# EAGLE design flight board (EAGLE 8.2.0)
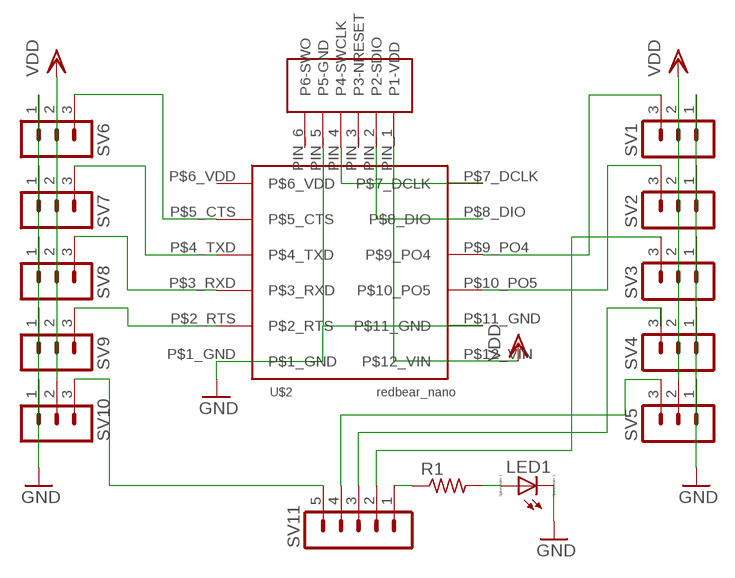
[diagram p0: schematic, sheet 1]

## Parts
LED1  LED_ESML0603  [LED_SML0603]
R1  R-US_R0603  [R0603]
SV1  MA03-1  [MA03-1]
SV2  MA03-1  [MA03-1]
SV3  MA03-1  [MA03-1]
SV4  MA03-1  [MA03-1]
SV5  MA03-1  [MA03-1]
SV6  MA03-1  [MA03-1]
SV7  MA03-1  [MA03-1]
SV8  MA03-1  [MA03-1]
SV9  MA03-1  [MA03-1]
SV10  MA03-1  [MA03-1]
SV11  MA05-1  [MA05-1]
U$1  TAG_CONNCET  [TAG_CONNECT]
U$2  REDBEAR_NANO  [REDBEAR_NANO]

## Nets
GND: LED1.C SV1.1 SV2.1 SV3.1 SV4.1 SV5.1 SV6.1 SV7.1 SV8.1 SV9.1 SV10.1 U$1.PIN_5(P5-GND) U$2.P$1_GND U$2.P$11_GND
N$1: SV6.3 U$2.P$5_CTS
N$2: SV7.3 U$2.P$4_TXD
N$3: U$1.PIN_4(P4-SWCLK) U$2.P$7_DCLK
N$4: U$1.PIN_2(P2-SDIO) U$2.P$8_DIO
N$5: SV8.3 U$2.P$3_RXD
N$6: SV9.3 U$2.P$2_RTS
N$7: SV10.3 SV11.5
N$8: R1.1 SV11.1
N$9: SV1.3 U$2.P$9_PO4
N$10: SV2.3 U$2.P$10_PO5
N$11: SV5.3 SV11.4
N$12: SV4.3 SV11.3
N$13: LED1.A R1.2
N$14: SV3.3 SV11.2
VDD: SV1.2 SV2.2 SV3.2 SV4.2 SV5.2 SV6.2 SV7.2 SV8.2 SV9.2 SV10.2 U$1.PIN_1(P1-VDD) U$2.P$12_VIN
Unconnected: U$1.PIN_3(P3-NRESET) U$1.PIN_6(P6-SWO) U$2.P$6_VDD

## Library data of the parts
LED1 = eagle-ltspice:LED_E: LED Source: http://www.osram.convergy.de Source: www.luxeon.com Source: www.kingbright.com; SPICEMODEL: NONE; SPICEPREFIX: D; SPICETYPE: diode
R1 = resistor:R-US_: RESISTOR, American symbol
SV1-SV10 = con-lstb:MA03-1: PIN HEADER; OC_FARNELL: unknown; OC_NEWARK: unknown
SV11 = con-lstb:MA05-1: PIN HEADER; OC_FARNELL: unknown; OC_NEWARK: unknown
U$1 = tag_connect:TAG_CONNCET
U$2 = redbearnano:REDBEAR_NANO

## Board
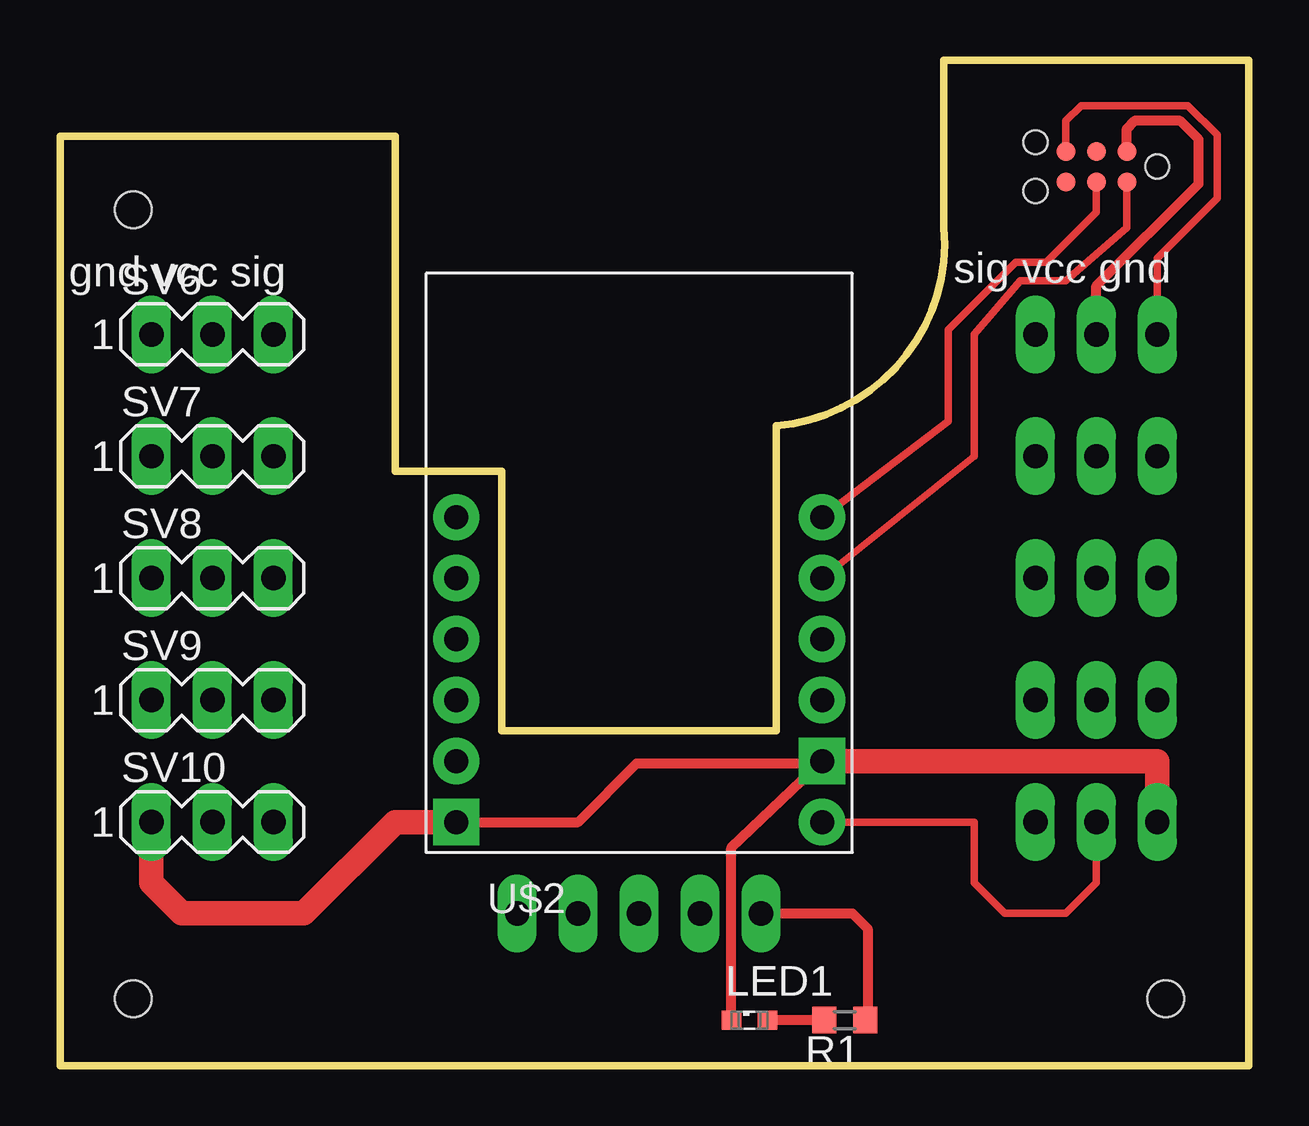
[diagram p1: board, top side]
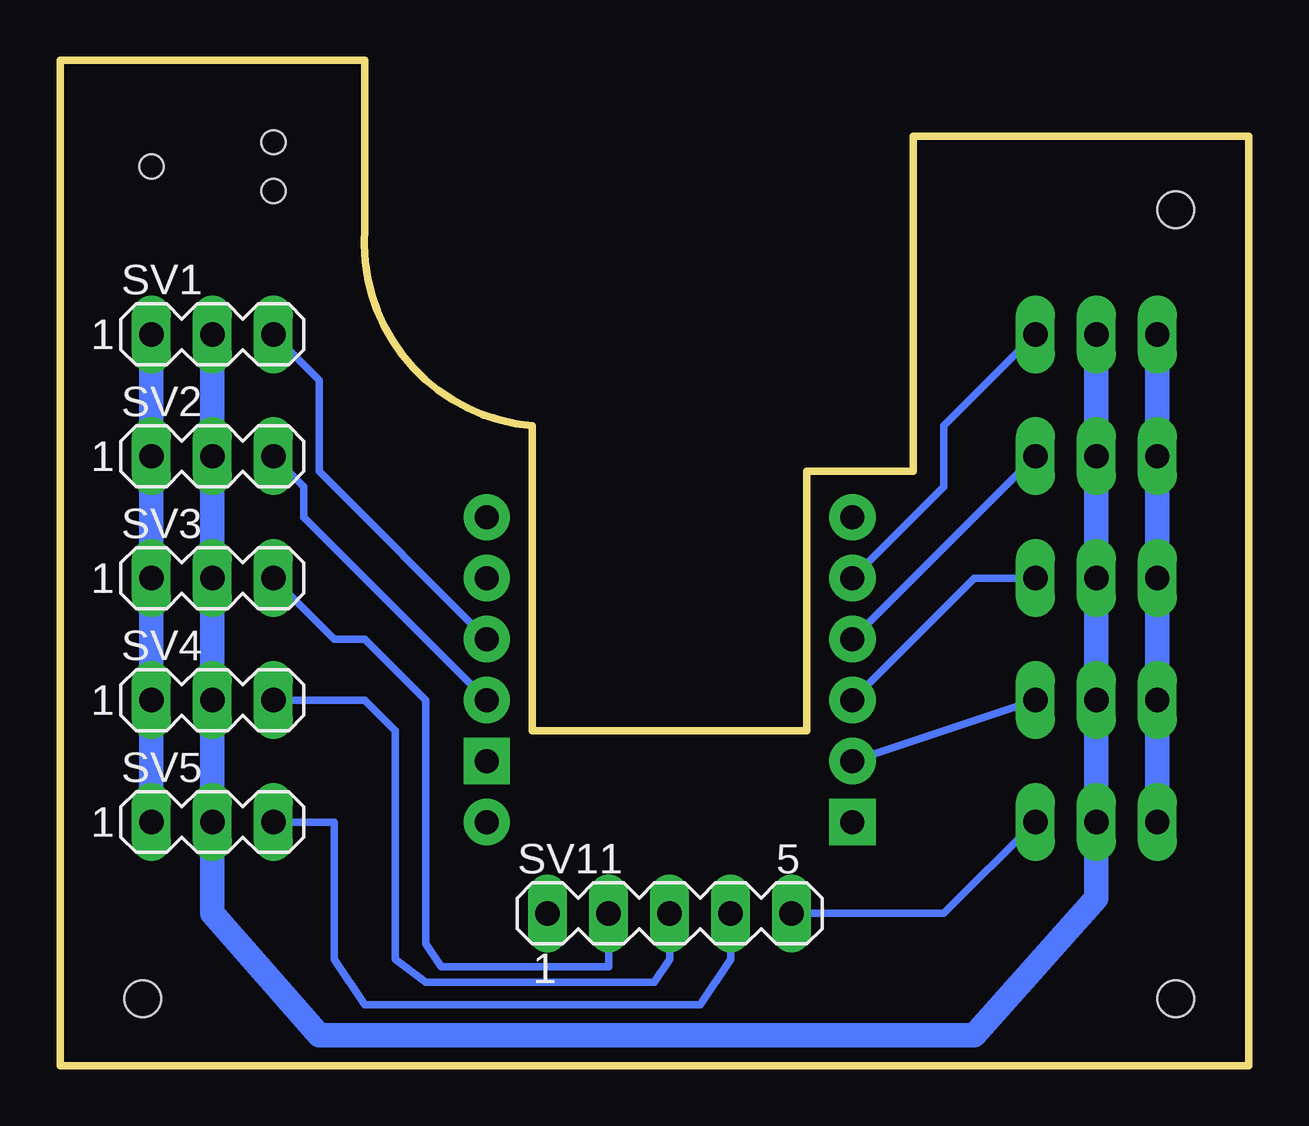
[diagram p2: board, bottom side, seen from below]

Size 49.53 x 41.91 mm. Coordinates in mm from the lower left corner, seen from the top.
Outline: 0,38.73 13.97,38.73 13.97,24.76 18.41,24.76 18.41,13.97 29.85,13.97 29.85,26.67 arc90 36.83,34.92 36.83,41.91 49.53,41.91 49.53,0 0,0 0,38.73
Copper layers (1*16): Top 0.035mm / dielectric 1.5mm / Bottom 0.035mm
Design rules "SparkFun": minimum track width 8mil, minimum drill 20mil, track to track 8mil, track to pad 8mil, pad to pad 8mil, via to via 8mil, smd to smd 8mil, copper to edge 8mil, drill to drill 8mil, minimum pad ring 12mil, minimum via ring 10mil, stop-mask expansion 4mil, vias tented up to drill 20mil, thermal gap 10mil
Holes 1.52 mm at 3.05,35.66 3.05,2.79 46.08,2.79

### Footprints (pad centres in the part's own frame; a part is rotated, then mirrored left to right if it is on the bottom)
LED_SML0603 = smd 0.8 x 0.8: A 0.75,0; C -0.75,0
R0603 = smd 1 x 1.1: 1 -0.85,0; 2 0.85,0
MA03-1 = drill 1.016 long: 1 -2.54,0; 2 0,0; 3 2.54,0
MA05-1 = drill 1.016 long: 1 -5.08,0; 2 -2.54,0; 3 0,0; 4 2.54,0; 5 5.08,0
TAG_CONNECT = smd 0.787 x 0.787: PIN_1 1.27,-0.635; PIN_2 1.27,0.635; PIN_3 2.54,-0.635; PIN_4 2.54,0.635; PIN_5 3.81,-0.635; PIN_6 3.81,0.635 | hole 1: 0,0; 5.08,1.016; 5.08,-1.016
REDBEAR_NANO = drill 1 pad 1.93 square: P$1_GND 0,0; P$11_GND 15.24,2.54 | drill 1 pad 1.93: P$2_RTS 0,2.54; P$3_RXD 0,5.08; P$4_TXD 0,7.62; P$5_CTS 0,10.16; P$6_VDD 0,12.7; P$7_DCLK 15.24,12.7; P$8_DIO 15.24,10.16; P$9_PO4 15.24,7.62; P$10_PO5 15.24,5.08; P$12_VIN 15.24,0

### Placement (x,y rotation side)
LED1  28.73,1.9 0 top
R1  32.7,1.9 180 top
SV1  43.18,30.48 0 bottom
SV2  43.18,25.4 0 bottom
SV3  43.18,20.32 0 bottom
SV4  43.18,15.24 0 bottom
SV5  43.18,10.16 0 bottom
SV6  6.35,30.48 0 top
SV7  6.35,25.4 0 top
SV8  6.35,20.32 0 top
SV9  6.35,15.24 0 top
SV10  6.35,10.16 0 top
SV11  24.13,6.35 0 bottom
U$1  45.72,37.47 180 top
U$2  16.51,10.16 0 top

### Tracks (layer width: path | path; a pad name or v marks a point on that pad's centre or on a via)
GND
  Top 0.305: SV1.1 45.72,33.66 48.21,36.14 48.21,38.79 46.99,40 42.55,40 41.91,39.37 U$1.PIN_5
  Top 0.406: LED1.C 27.98,9.09 U$2.P$11_GND 31.65,12.6 24.03,12.6 21.59,10.16 U$2.P$1_GND
  Top 1.016: U$2.P$1_GND 13.97,10.16 10.16,6.35 5.08,6.35 3.81,7.62 SV10.1 | U$2.P$11_GND 45.72,12.7 SV5.1
  Bottom 1.016: SV1.1 SV2.1 SV3.1 | SV3.1 45.72,19.68 | SV3.1 SV4.1 SV5.1 | SV6.1 SV7.1 SV8.1 | SV8.1 3.81,19.68 | SV8.1 SV9.1 SV10.1
N$1
  Bottom 0.305: U$2.P$5_CTS 12.7,24.13 12.7,26.67 SV6.3
N$2
  Bottom 0.305: U$2.P$4_TXD SV7.3
N$3
  Top 0.305: U$1.PIN_4 43.18,35.56 41.1,33.48 39.82,33.48 37.01,30.67 37.01,26.85 35.7,25.85 U$2.P$7_DCLK
N$4
  Top 0.305: U$2.P$8_DIO 38.1,25.4 38.1,30.48 40,32.7 41.91,32.7 44.45,34.92 U$1.PIN_2
N$5
  Bottom 0.305: SV8.3 11.43,20.32 U$2.P$3_RXD
N$6
  Bottom 0.305: U$2.P$2_RTS SV9.3
N$7
  Bottom 0.305: SV11.5 12.7,6.35 SV10.3
N$8
  Top 0.406: SV11.1 33.02,6.35 33.66,5.71 33.66,2.01 R1.1
N$9
  Bottom 0.305: U$2.P$9_PO4 38.73,24.76 38.73,28.57 SV1.3
N$10
  Bottom 0.305: SV2.3 39.37,24.13 39.37,22.86 U$2.P$10_PO5
N$11
  Bottom 0.305: SV5.3 38.1,10.16 38.1,4.45 36.83,2.54 22.86,2.54 21.59,4.45 SV11.4
N$12
  Bottom 0.305: SV4.3 36.83,15.24 35.56,13.97 35.56,4.45 34.29,3.49 24.76,3.49 24.13,4.45 SV11.3
N$13
  Top 0.406: R1.2 LED1.A
N$14
  Bottom 0.305: SV3.3 38.1,17.78 36.83,17.78 34.29,15.24 34.29,5.08 33.66,4.13 26.67,4.13 SV11.2
VDD
  Top 0.305: U$2.P$12_VIN 38.1,10.16 38.1,7.62 39.37,6.35 41.91,6.35 43.18,7.62 SV5.2
  Top 0.406: SV1.2 43.18,32.49 47.44,36.75 47.44,38.6 46.67,39.37 44.77,39.37 44.45,39.05 U$1.PIN_1
  Bottom 1.016: SV1.2 SV2.2 SV3.2 SV4.2 SV5.2 43.18,6.35 38.73,1.27 11.43,1.27 6.35,6.98 SV10.2 SV9.2 SV8.2 SV7.2 SV6.2

### Text on the board
tPlace: gnd vcc sig | sig vcc gnd